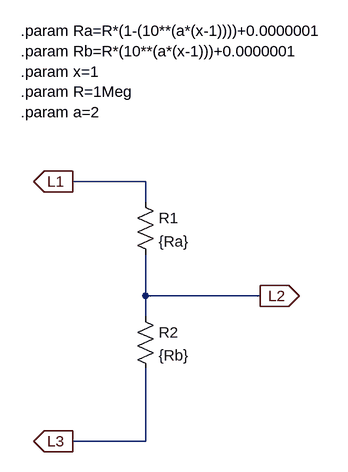
[diagram p0: schematic A1Meg.asc]
A1Meg.asc, the LTspice schematic file:
Version 4
SHEET 1 880 680
WIRE 96 128 -16 128
WIRE 96 160 96 128
WIRE 96 304 96 240
WIRE 272 304 96 304
WIRE 96 336 96 304
WIRE 96 528 96 416
WIRE 96 528 -16 528
FLAG 272 304 L2
IOPIN 272 304 Out
FLAG -16 128 L1
IOPIN -16 128 Out
FLAG -16 528 L3
IOPIN -16 528 Out
SYMBOL res 80 144 R0
SYMATTR InstName R1
SYMATTR Value {Ra}
SYMBOL res 80 320 R0
SYMATTR InstName R2
SYMATTR Value {Rb}
TEXT -96 -104 Left 2 !.param Ra=R*(1-(10**(a*(x-1))))+0.0000001\n.param Rb=R*(10**(a*(x-1)))+0.0000001\n.param x=1\n.param R=1Meg\n.param a=2

The netlist it stands for:
* A1Meg.asc
R1 L1 L2 {Ra}
R2 L2 L3 {Rb}
.param Ra=R*(1-(10**(a*(x-1))))+0.0000001
.param Rb=R*(10**(a*(x-1)))+0.0000001
.param x=1
.param R=1Meg
.param a=2
.backanno
.end